# EAGLE design shinobi_3V3_5v (EAGLE 8.2.2)
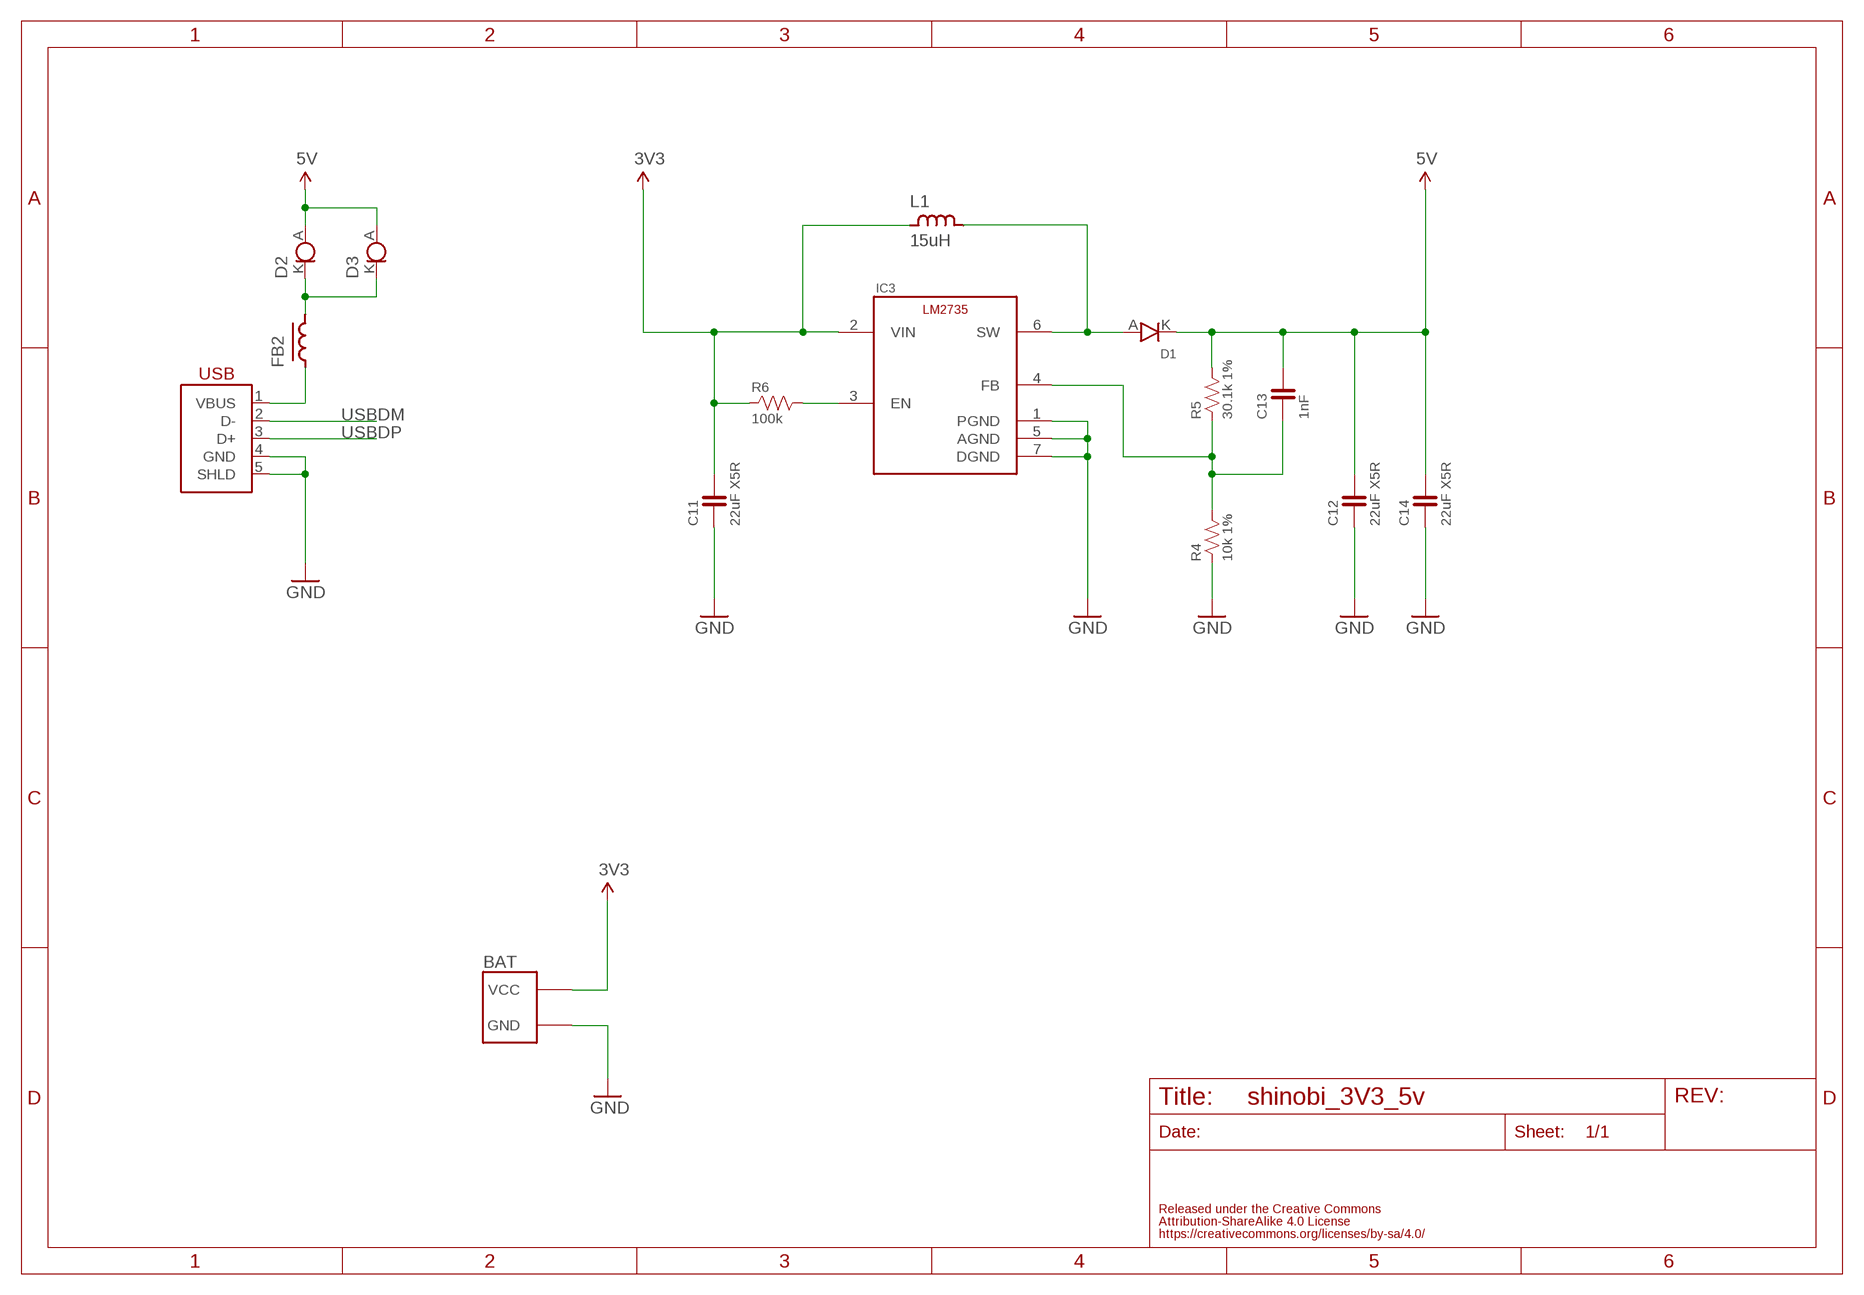
[diagram p0: schematic, sheet 1]

## Parts
BAT  FABO_BRICK_2PIN_SIDE  [FABO_BRICK_2PIN_S02B−PASK-2_SILK]
C11  22uF X5R  CAPACITOR-0603_NARROW  [0603-NARROW]
C12  22uF X5R  CAPACITOR-0603_NARROW  [0603-NARROW]
C13  1nF  CAPACITOR-0603_NARROW  [0603-NARROW]
C14  22uF X5R  CAPACITOR-0603_NARROW  [0603-NARROW]
D1  20V1A  DIODE-STPS120MF  [ST-MITE-FLAT]
D2  CRD_S-153T  [CRD-S-153T]
D3  CRD_S-153T  [CRD-S-153T]
FB2  FERRITEBEADS  [EIA0603]
IC3  LM2735YQSDX  [WSON-6]
L1  15uH  INDUCTOR-NR6028  [NR6028]
R4  10k 1%  RESISTOR-0603-NARROW  [0603-NARROW]
R5  30.1k 1%  RESISTOR-0603-NARROW  [0603-NARROW]
R6  100k  RESISTOR-0603-NARROW  [0603-NARROW]
USB1  USB-CONN_SMT  [SM05B-PASS]

## Nets
3V3: BAT.VCC C11.2 IC3.2(VIN) L1.1 R6.1
5V: C12.2 C13.2 C14.2 D1.K D2.A D3.A R5.2
DCDCEN: IC3.3(EN) R6.2
FB: C13.1 IC3.4(FB) R4.2 R5.1
GND: BAT.GND C11.1 C12.1 C14.1 IC3.1(PGND) IC3.5(AGND) IC3.7(DGND) R4.1 USB1.4(GND) USB1.5(SHLD)
N$3: D2.K D3.K FB2.2
SW: D1.A IC3.6(SW) L1.2
USBDM: USB1.2(D-)
USBDP: USB1.3(D+)
USBVBUS: FB2.1 USB1.1(VBUS)

## Library data of the parts
BAT = FaBo-Template:FABO_BRICK_2PIN
C11-C14 = FaBo-Capacitor:CAPACITOR: CAPACITOR
D1 = FaBo-Parts:DIODE
D2 D3 = FaBo-etc:CRD
FB2 = FaBo-etc:FERRITEBEADS
IC3 = FaBo-Supply:LM2735
L1 = FaBo-Parts:INDUCTOR
R4-R6 = FaBo-Resistors:RESISTOR: RESISTOR
USB1 = FaBo-USB:USB-CONN

## Board
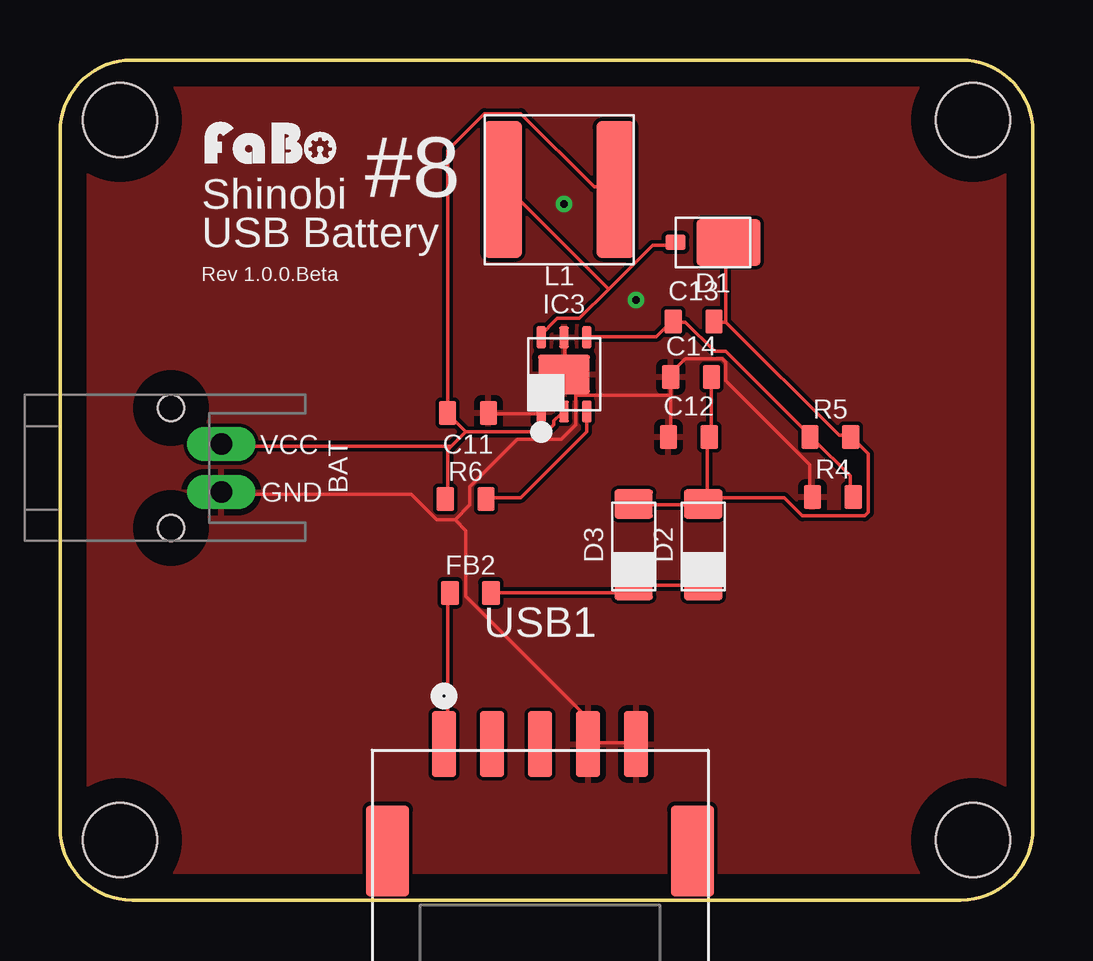
[diagram p1: board, top side]
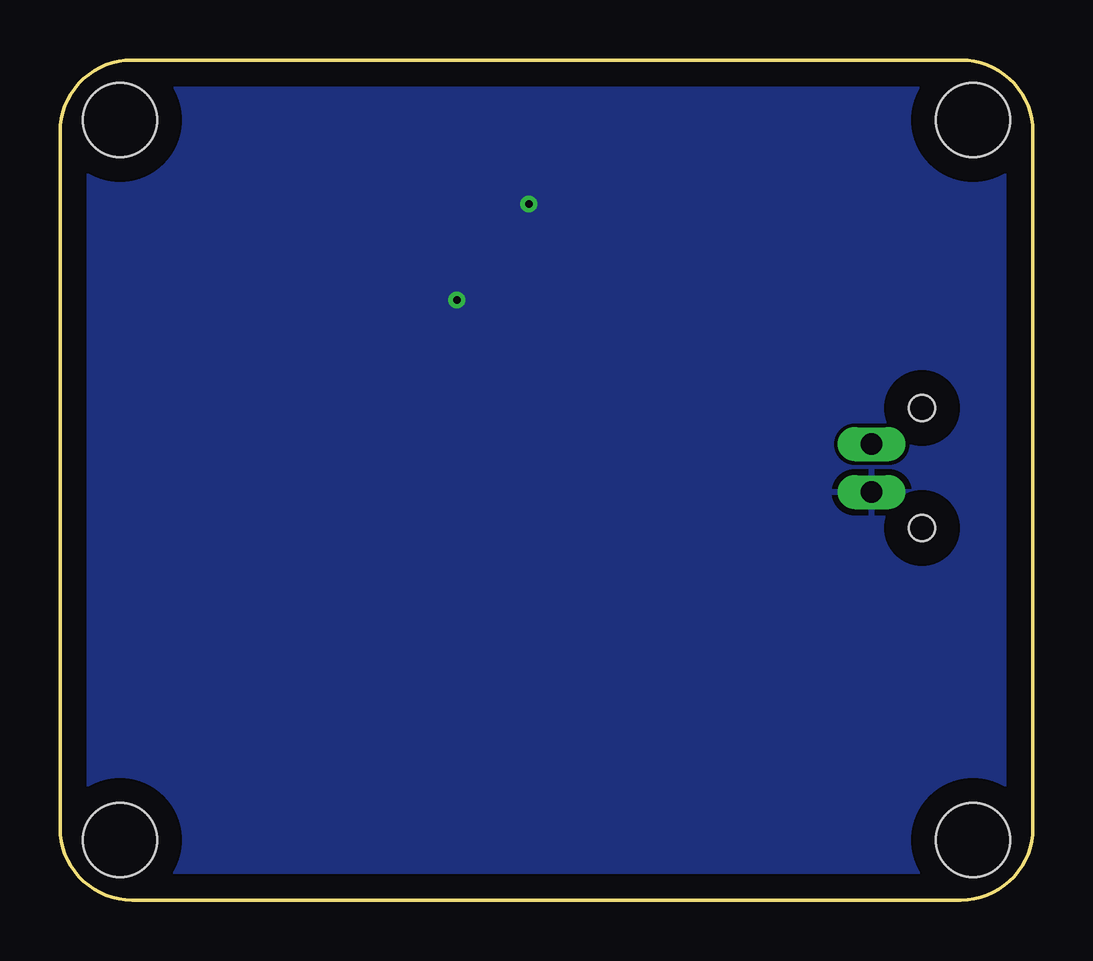
[diagram p2: board, bottom side, seen from below]

Size 40.54 x 35 mm. Coordinates in mm from the lower left corner, seen from the top.
Copper layers (1*16): Top 0.035mm / dielectric 1.5mm / Bottom 0.035mm
Design rules "default": minimum track width 6mil, minimum drill 0.35mm, track to track 6mil, track to pad 6mil, pad to pad 6mil, via to via 6mil, smd to smd 6mil, copper to edge 40mil, drill to drill 6mil, minimum pad ring 10mil, minimum via ring 8mil, stop-mask expansion 4mil, vias tented up to drill 0mil, thermal gap 10mil

### Footprints (pad centres in the part's own frame; a part is rotated, then mirrored left to right if it is on the bottom)
FABO_BRICK_2PIN_S02B−PASK-2_SILK = drill 0.9 pad 1.422 long: GND -1,-0.102; VCC 1,-0.102 | hole 1.1: 2.5,1.998; -2.5,1.998
0603-NARROW = smd 0.71 x 1: 1 -0.85,0; 2 0.85,0
ST-MITE-FLAT = smd 0.85 x 0.65: A 1.55,0 | smd 2.65 x 1.95: K -0.65,0
CRD-S-153T = smd 1.2 x 1.6: A 1.7,0; K -1.7,0
EIA0603 = smd 0.75 x 1: 1 -0.85,0; 2 0.85,0
WSON-6 = smd 0.4 x 0.9: 1 -0.95,-1.55; 2 0,-1.55; 3 0.95,-1.55; 4 0.95,1.55; 5 0,1.55; 6 -0.95,1.55 | smd 2.15 x 1.65: 7 0,0
NR6028 = smd 1.6 x 5.7: 1 -2.35,0; 2 2.35,0
FABO-SHINOBI = hole 3.1: 2.5,32.5; 38.04,32.5; 38.04,2.5; 2.5,2.5
SM05B-PASS = smd 1 x 2.7: 1 4,0; 2 2,0; 3 0,0; 4 -2,0; 5 -4,0 | smd 1.8 x 3.8: P$1 6.35,4.45; P$2 -6.35,4.45

### Placement (x,y rotation side)
BAT  6.62,18 90 top
C11  17,20.3 180 top
C12  26.2,19.3 0 top
C13  26.4,24.1 0 top
C14  26.3,21.8 0 top
D1  27.2,27.4 180 top
D2  26.8,14.8 90 top
D3  23.9,14.8 90 top
FB2  17.1,12.8 0 top
IC3  21,21.9 0 top
L1  20.8,29.6 180 top
R4  32.2,16.8 0 top
R5  32.1,19.3 0 top
R6  16.9,16.7 0 top
U$2  [LOGO_FABO_S]  8.83,30.52 0 top
U$3  [FABO-SHINOBI]  0,0 0 top
USB1  20,6.5 180 top

### Tracks (layer width: path | path; a pad name or v marks a point on that pad's centre or on a via)
3V3
  Top 0.152: 16.92,19.51 20.27,19.51 20.57,19.81 20.57,19.96 20.88,20.27 IC3.2 | 16.92,19.51 16.15,20.27 C11.2 16.15,20.42 16.15,31.24 17.68,32.77 19.2,32.77 22.25,29.72 23.01,29.72 L1.1 | 16.92,19.51 16.31,18.9 | 16.31,18.9 16.15,18.75 16.15,16.76 R6.1 | 16.31,18.9 6.86,18.9 BAT.VCC
5V
  Top 0.152: C14.2 27.13,21.79 27.13,19.36 C12.2 26.98,19.2 26.98,16.76 | D3.A 23.93,16.46 26.67,16.46 D2.A | 26.98,16.76 26.82,16.61 D2.A | 27.74,24.08 32.46,19.36 32.92,19.36 R5.2 33.07,19.2 33.68,18.59 33.68,16.15 33.53,16 30.94,16 30.18,16.76 26.98,16.76 | 27.74,24.08 27.28,24.08 C13.2 | 27.74,24.08 27.74,27.28 D1.K | 26.98,16.76 D2.A
DCDCEN
  Top 0.152: IC3.3 21.95,20.27 21.95,19.51 19.2,16.76 17.83,16.76 R6.2
FB
  Top 0.152: IC3.4 22.1,23.47 24.84,23.47 25.45,24.08 C13.1 25.6,24.08 26.06,24.08 27.28,22.86 27.74,22.86 31.24,19.36 R5.1 31.39,19.2 32.92,17.68 32.92,16.92 R4.2
GND  (via drill 0.3)
  Top 0.152: 25.45,21.03 C14.1 25.45,21.95 26.06,22.55 27.58,22.55 27.74,22.4 27.74,21.64 31.24,18.14 31.24,16.92 R4.1 | 25.45,21.03 25.45,19.36 C12.1 | USB1.5 23.93,6.55 22.1,6.55 USB1.4 21.95,6.55 21.95,7.62 16.92,12.65 16.92,15.39 16.46,15.85 | IC3.7 20.88,21.79 20.12,21.03 20.12,20.42 IC3.1 19.96,20.27 17.98,20.27 C11.1 | IC3.5 21.03,23.32 21.03,21.95 IC3.7 | 16.46,15.85 15.7,15.85 14.63,16.92 6.86,16.92 BAT.GND | 16.46,15.85 17.07,16.46 17.07,17.22 19.05,19.2 20.88,19.2 21.49,19.81 21.49,21.03 | 21.49,21.03 21.49,21.34 21.03,21.79 IC3.7 | 21.49,21.03 25.45,21.03
  other vias: 21,29 24,25
  pour Bottom: 0,0 41,0 41,35 0,35
  pour Top: 0,0 41,0 41,35 0,35
N$3
  Top 0.152: FB2.2 17.98,12.8 23.62,12.8 23.77,12.95 D3.K 23.93,13.11 26.67,13.11 D2.K
SW
  Top 0.152: 22.86,25.45 21.64,24.23 20.73,24.23 19.96,23.47 IC3.6 | 22.86,25.45 24.69,27.28 25.6,27.28 D1.A | 22.86,25.45 18.59,29.72 L1.2
USBVBUS
  Top 0.152: FB2.1 16.15,12.65 16.15,6.71 16,6.55 USB1.1

### Text on the board
tPlace: Shinobi | #8 | USB Battery | Rev 1.0.0.Beta